# Altium schematic sheet Sheet1.SchDoc
size A4; SheetNumber: 1; SheetTotal: 2
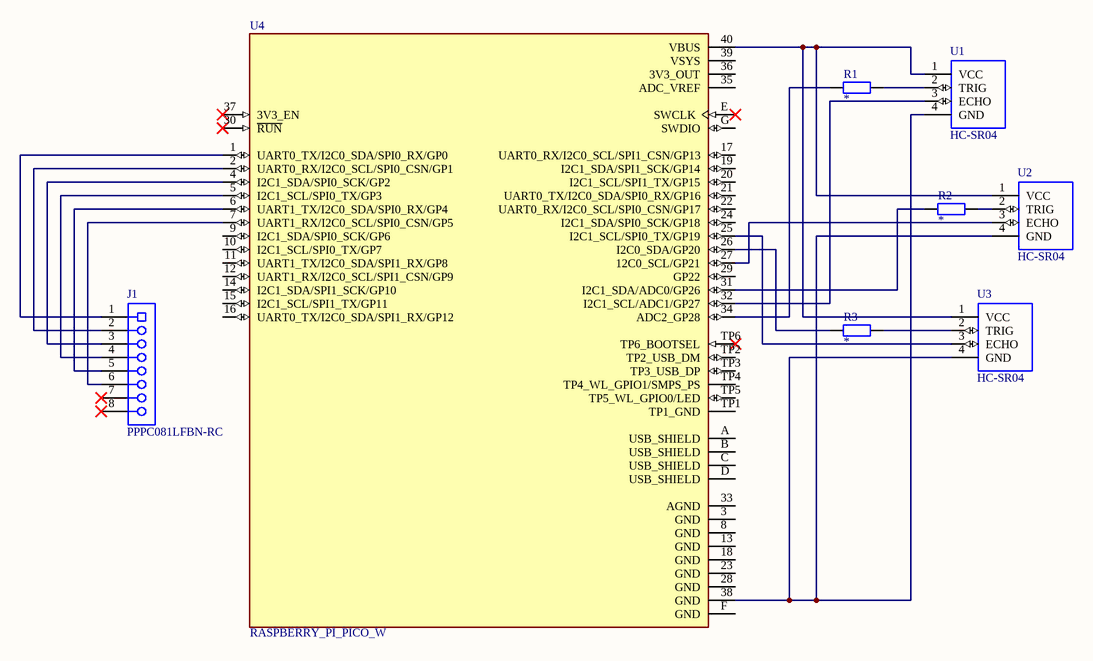
[diagram p0: Sheet1.SchDoc]

## Parts
J1  PPPC081LFBN-RC  [SLIN-PPPC081LFBN-RC_V]
R1  *  [AXIAL-0.4]
R2  *  [AXIAL-0.4]
R3  *  [AXIAL-0.4]
U1  HC-SR04  [XCVR_HC-SR04]
U2  HC-SR04  [XCVR_HC-SR04]
U3  HC-SR04  [XCVR_HC-SR04]
U4  RASPBERRY_PI_PICO_W  [MODULE_RASPBERRY_PI_PICO_W]

## Nets
NetJ1_1: J1.1 U4.1(UART0_TX/I2C0_SDA/SPI0_RX/GP0)
NetJ1_2: J1.2 U4.2(UART0_RX/I2C0_SCL/SPI0_CSN/GP1)
NetJ1_3: J1.3 U4.4(I2C1_SDA/SPI0_SCK/GP2)
NetJ1_4: J1.4 U4.5(I2C1_SCL/SPI0_TX/GP3)
NetJ1_5: J1.5 U4.6(UART1_TX/I2C0_SDA/SPI0_RX/GP4)
NetJ1_6: J1.6 U4.7(UART1_RX/I2C0_SCL/SPI0_CSN/GP5)
NetR1_1: R1.1 U4.34(ADC2_GP28)
NetR1_2: R1.2 U1.2(TRIG)
NetR2_1: R2.1 U4.31(I2C1_SDA/ADC0/GP26)
NetR2_2: R2.2 U2.2(TRIG)
NetR3_1: R3.1 U4.26(I2C0_SDA/GP20)
NetR3_2: R3.2 U3.2(TRIG)
NetU1_1: U1.1(VCC) U2.1(VCC) U3.1(VCC) U4.40(VBUS)
NetU1_3: U1.3(ECHO) U4.32(I2C1_SCL/ADC1/GP27)
NetU1_4: U1.4(GND) U2.4(GND) U3.4(GND) U4.38(GND)
NetU2_3: U2.3(ECHO) U4.27(12C0_SCL/GP21)
NetU3_3: U3.3(ECHO) U4.25(I2C1_SCL/SPI0_TX/GP19)

Not connected (* = marked no-connect by the designer): J1 7* 8*; U4 3(GND) 8(GND) 9(I2C1_SDA/SPI0_SCK/GP6) 10(I2C1_SCL/SPI0_TX/GP7) 11(UART1_TX/I2C0_SDA/SPI1_RX/GP8) 12(UART1_RX/I2C0_SCL/SPI1_CSN/GP9) 13(GND) 14(I2C1_SDA/SPI1_SCK/GP10) 15(I2C1_SCL/SPI1_TX/GP11) 16(UART0_TX/I2C0_SDA/SPI1_RX/GP12) 17(UART0_RX/I2C0_SCL/SPI1_CSN/GP13) 18(GND) 19(I2C1_SDA/SPI1_SCK/GP14) 20(I2C1_SCL/SPI1_TX/GP15) 21(UART0_TX/I2C0_SDA/SPI0_RX/GP16) 22(UART0_RX/I2C0_SCL/SPI0_CSN/GP17) 23(GND) 24(I2C1_SDA/SPI0_SCK/GP18) 28(GND) 29(GP22) 30(~{RUN})* 33(AGND) 35(ADC_VREF) 36(3V3_OUT) 37(3V3_EN)* 39(VSYS) A(USB_SHIELD) B(USB_SHIELD) C(USB_SHIELD) D(USB_SHIELD) E(SWCLK)* F(GND) G(SWDIO) TP1(TP1_GND) TP2(TP2_USB_DM) TP3(TP3_USB_DP) TP4(TP4_WL_GPIO1/SMPS_PS) TP5(TP5_WL_GPIO0/LED) TP6(TP6_BOOTSEL)*

## Library data of the parts
J1 = CMP-002-00028-2: Female Header, Pitch 2.54 mm, 1 x 8 Position, Height 8.5 mm, Tail Length 3.2 mm, -40 to 105 degC, RoHS, Bulk; Manufacturer: Sullins; Package Reference: PPPC081LFBN-RC; Connector Type: Header; Datasheet Version: Jan-15; Package Description: Female Header, Pitch 2.54 mm, 1 x 8 Position, Height 8.5 mm, Tail Length 3.2 mm; RoHS Compliant: Unknown; Max Operating Temperature: 105°C; Case/Package: PPPC081LFBN-RC; Min Operating Temperature: -40°C; Datasheet URL: http://sullinscorp.com/catalogs/101_PAGE114-115_.100_FEMALE_HDR.pdf; Gender: Female; Mounting Technology: TH
R1-R3 = Res_TH_0AX4: Through hole resistor; Published: 8-Jun-2000; LatestRevisionDate: 17-Jul-2002; LatestRevisionNote: Re-released for DXP Platform.; PackageReference: AXIAL-0.4; Publisher: Altium Limited; Value: *; ComponentLink1Description: http://www.royalohm.com/pdf/product2017/PrecisionMetalMF.pdf
U1-U3 = HC-SR04: Ultrasonic Sensor Module; Availability: Unavailable; MP: HC-SR04; Value: *; Price: None; Package: None
U4 = RASPBERRY_PI_PICO_W: Raspberry Pi Board, Arm Cortex-M0+; Silicon Manufacturer:Raspberry Pi; No. Of Bits:32Bit; Silicon Family Name:-; Core Architecture:Arm; Core Sub-Architecture:Cortex-M0+; Silicon Core Number:Rp2040; Product Range:Raspberry Pi Pico Rohs Compliant: Yes |Raspberry-Pi RASPBERRY PI PICO W; SnapEDA_Link: https://www.snapeda.com/parts/RASPBERRY%20PI%20PICO%20W/Raspberry+Pi/view-part/?ref=snap; Package: None; Value: *; MF: Raspberry Pi; MP: RASPBERRY PI PICO W; Check_prices: https://www.snapeda.com/parts/RASPBERRY%20PI%20PICO%20W/Raspberry+Pi/view-part/?ref=eda